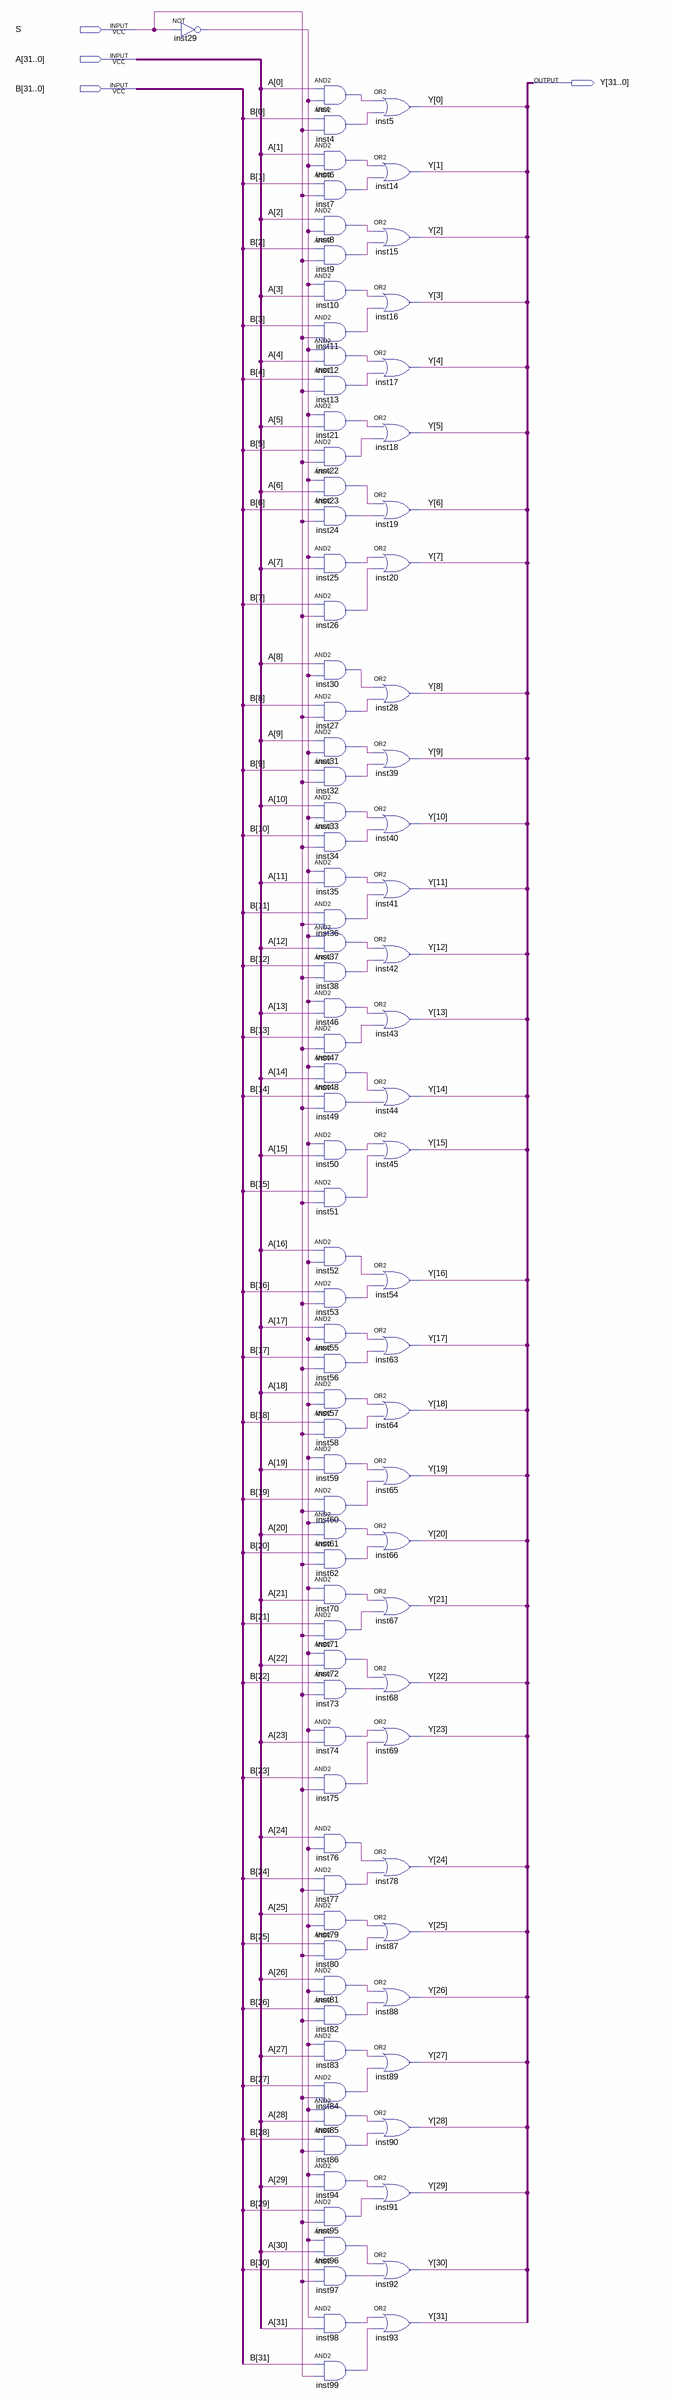
[diagram p0: schematic sheet]
// Quartus schematic MUX2X1_32bits.bdf as structural Verilog: 97 symbols, 4 pins
module MUX2X1_32bits (
  input  S,
  input  [31:0] A,
  input  [31:0] B,
  output [31:0] Y
);

  wire inst4_out, inst6_out, inst7_out, inst8_out, inst9_out, inst10_out, inst11_out, inst12_out, inst13_out,
       inst21_out, inst22_out, inst23_out, inst24_out, inst25_out, inst26_out, inst27_out, inst29_out,
       inst30_out, inst31_out, inst32_out, inst33_out, inst34_out, inst35_out, inst36_out, inst37_out,
       inst38_out, inst46_out, inst47_out, inst48_out, inst49_out, inst50_out, inst51_out, inst52_out,
       inst53_out, inst55_out, inst56_out, inst57_out, inst58_out, inst59_out, inst60_out, inst61_out,
       inst62_out, inst70_out, inst71_out, inst72_out, inst73_out, inst74_out, inst75_out, inst76_out,
       inst77_out, inst79_out, inst80_out, inst81_out, inst82_out, inst83_out, inst84_out, inst85_out,
       inst86_out, inst94_out, inst95_out, inst96_out, inst97_out, inst98_out, inst99_out, inst_out;

  not inst29 (inst29_out, S);
  and inst (inst_out, A[0], inst29_out);
  and inst4 (inst4_out, B[0], S);
  and inst6 (inst6_out, A[1], inst29_out);
  and inst7 (inst7_out, B[1], S);
  and inst8 (inst8_out, A[2], inst29_out);
  and inst9 (inst9_out, B[2], S);
  and inst10 (inst10_out, inst29_out, A[3]);
  and inst11 (inst11_out, B[3], S);
  and inst12 (inst12_out, inst29_out, A[4]);
  and inst13 (inst13_out, B[4], S);
  and inst21 (inst21_out, inst29_out, A[5]);
  and inst22 (inst22_out, B[5], S);
  and inst23 (inst23_out, inst29_out, A[6]);
  and inst24 (inst24_out, B[6], S);
  and inst25 (inst25_out, inst29_out, A[7]);
  and inst26 (inst26_out, B[7], S);
  and inst30 (inst30_out, A[8], inst29_out);
  and inst27 (inst27_out, B[8], S);
  and inst31 (inst31_out, A[9], inst29_out);
  and inst32 (inst32_out, B[9], S);
  and inst33 (inst33_out, A[10], inst29_out);
  and inst34 (inst34_out, B[10], S);
  and inst35 (inst35_out, inst29_out, A[11]);
  and inst36 (inst36_out, B[11], S);
  and inst37 (inst37_out, inst29_out, A[12]);
  and inst38 (inst38_out, B[12], S);
  and inst46 (inst46_out, inst29_out, A[13]);
  and inst47 (inst47_out, B[13], S);
  and inst48 (inst48_out, inst29_out, A[14]);
  and inst49 (inst49_out, B[14], S);
  and inst50 (inst50_out, inst29_out, A[15]);
  and inst51 (inst51_out, B[15], S);
  and inst52 (inst52_out, A[16], inst29_out);
  and inst53 (inst53_out, B[16], S);
  and inst55 (inst55_out, A[17], inst29_out);
  and inst56 (inst56_out, B[17], S);
  and inst57 (inst57_out, A[18], inst29_out);
  and inst58 (inst58_out, B[18], S);
  and inst59 (inst59_out, inst29_out, A[19]);
  and inst60 (inst60_out, B[19], S);
  and inst61 (inst61_out, inst29_out, A[20]);
  and inst62 (inst62_out, B[20], S);
  and inst70 (inst70_out, inst29_out, A[21]);
  and inst71 (inst71_out, B[21], S);
  and inst72 (inst72_out, inst29_out, A[22]);
  and inst73 (inst73_out, B[22], S);
  and inst74 (inst74_out, inst29_out, A[23]);
  and inst75 (inst75_out, B[23], S);
  and inst76 (inst76_out, A[24], inst29_out);
  and inst77 (inst77_out, B[24], S);
  and inst79 (inst79_out, A[25], inst29_out);
  and inst80 (inst80_out, B[25], S);
  and inst81 (inst81_out, A[26], inst29_out);
  and inst82 (inst82_out, B[26], S);
  and inst83 (inst83_out, inst29_out, A[27]);
  and inst84 (inst84_out, B[27], S);
  and inst85 (inst85_out, inst29_out, A[28]);
  and inst86 (inst86_out, B[28], S);
  and inst94 (inst94_out, inst29_out, A[29]);
  and inst95 (inst95_out, B[29], S);
  and inst96 (inst96_out, inst29_out, A[30]);
  and inst97 (inst97_out, B[30], S);
  and inst98 (inst98_out, inst29_out, A[31]);
  and inst99 (inst99_out, B[31], S);
  or inst5 (Y[0], inst_out, inst4_out);
  or inst14 (Y[1], inst6_out, inst7_out);
  or inst15 (Y[2], inst8_out, inst9_out);
  or inst16 (Y[3], inst10_out, inst11_out);
  or inst17 (Y[4], inst12_out, inst13_out);
  or inst18 (Y[5], inst21_out, inst22_out);
  or inst19 (Y[6], inst23_out, inst24_out);
  or inst20 (Y[7], inst25_out, inst26_out);
  or inst28 (Y[8], inst30_out, inst27_out);
  or inst39 (Y[9], inst31_out, inst32_out);
  or inst40 (Y[10], inst33_out, inst34_out);
  or inst41 (Y[11], inst35_out, inst36_out);
  or inst42 (Y[12], inst37_out, inst38_out);
  or inst43 (Y[13], inst46_out, inst47_out);
  or inst44 (Y[14], inst48_out, inst49_out);
  or inst45 (Y[15], inst50_out, inst51_out);
  or inst54 (Y[16], inst52_out, inst53_out);
  or inst63 (Y[17], inst55_out, inst56_out);
  or inst64 (Y[18], inst57_out, inst58_out);
  or inst65 (Y[19], inst59_out, inst60_out);
  or inst66 (Y[20], inst61_out, inst62_out);
  or inst67 (Y[21], inst70_out, inst71_out);
  or inst68 (Y[22], inst72_out, inst73_out);
  or inst69 (Y[23], inst74_out, inst75_out);
  or inst78 (Y[24], inst76_out, inst77_out);
  or inst87 (Y[25], inst79_out, inst80_out);
  or inst88 (Y[26], inst81_out, inst82_out);
  or inst89 (Y[27], inst83_out, inst84_out);
  or inst90 (Y[28], inst85_out, inst86_out);
  or inst91 (Y[29], inst94_out, inst95_out);
  or inst92 (Y[30], inst96_out, inst97_out);
  or inst93 (Y[31], inst98_out, inst99_out);
endmodule
